# Altium schematic sheet 主板原理图第3次.SchDoc
size A2
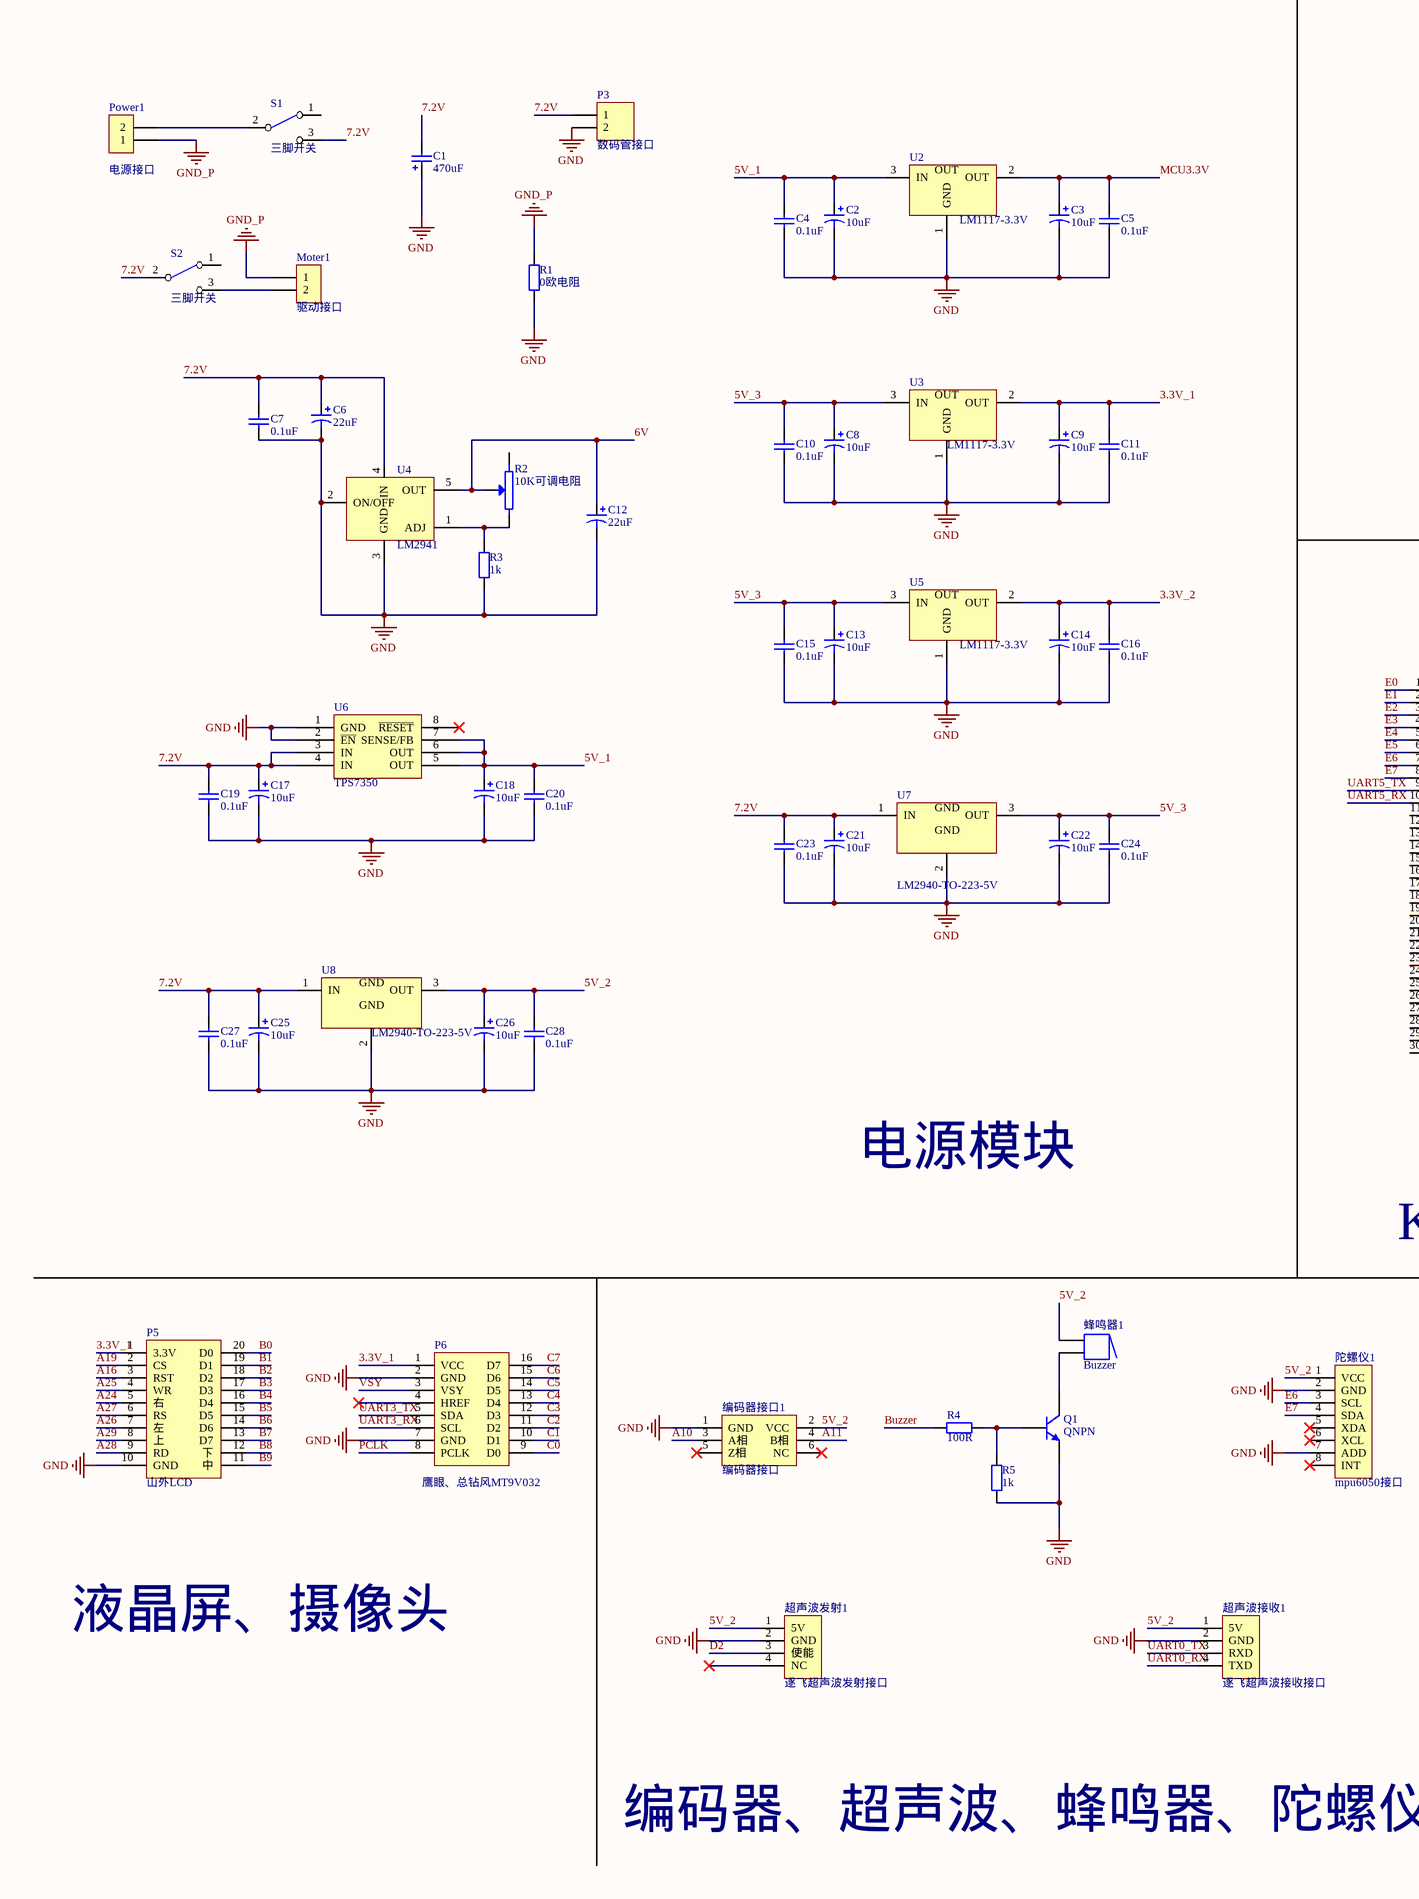
[diagram p0: 主板原理图第3次.SchDoc, left]
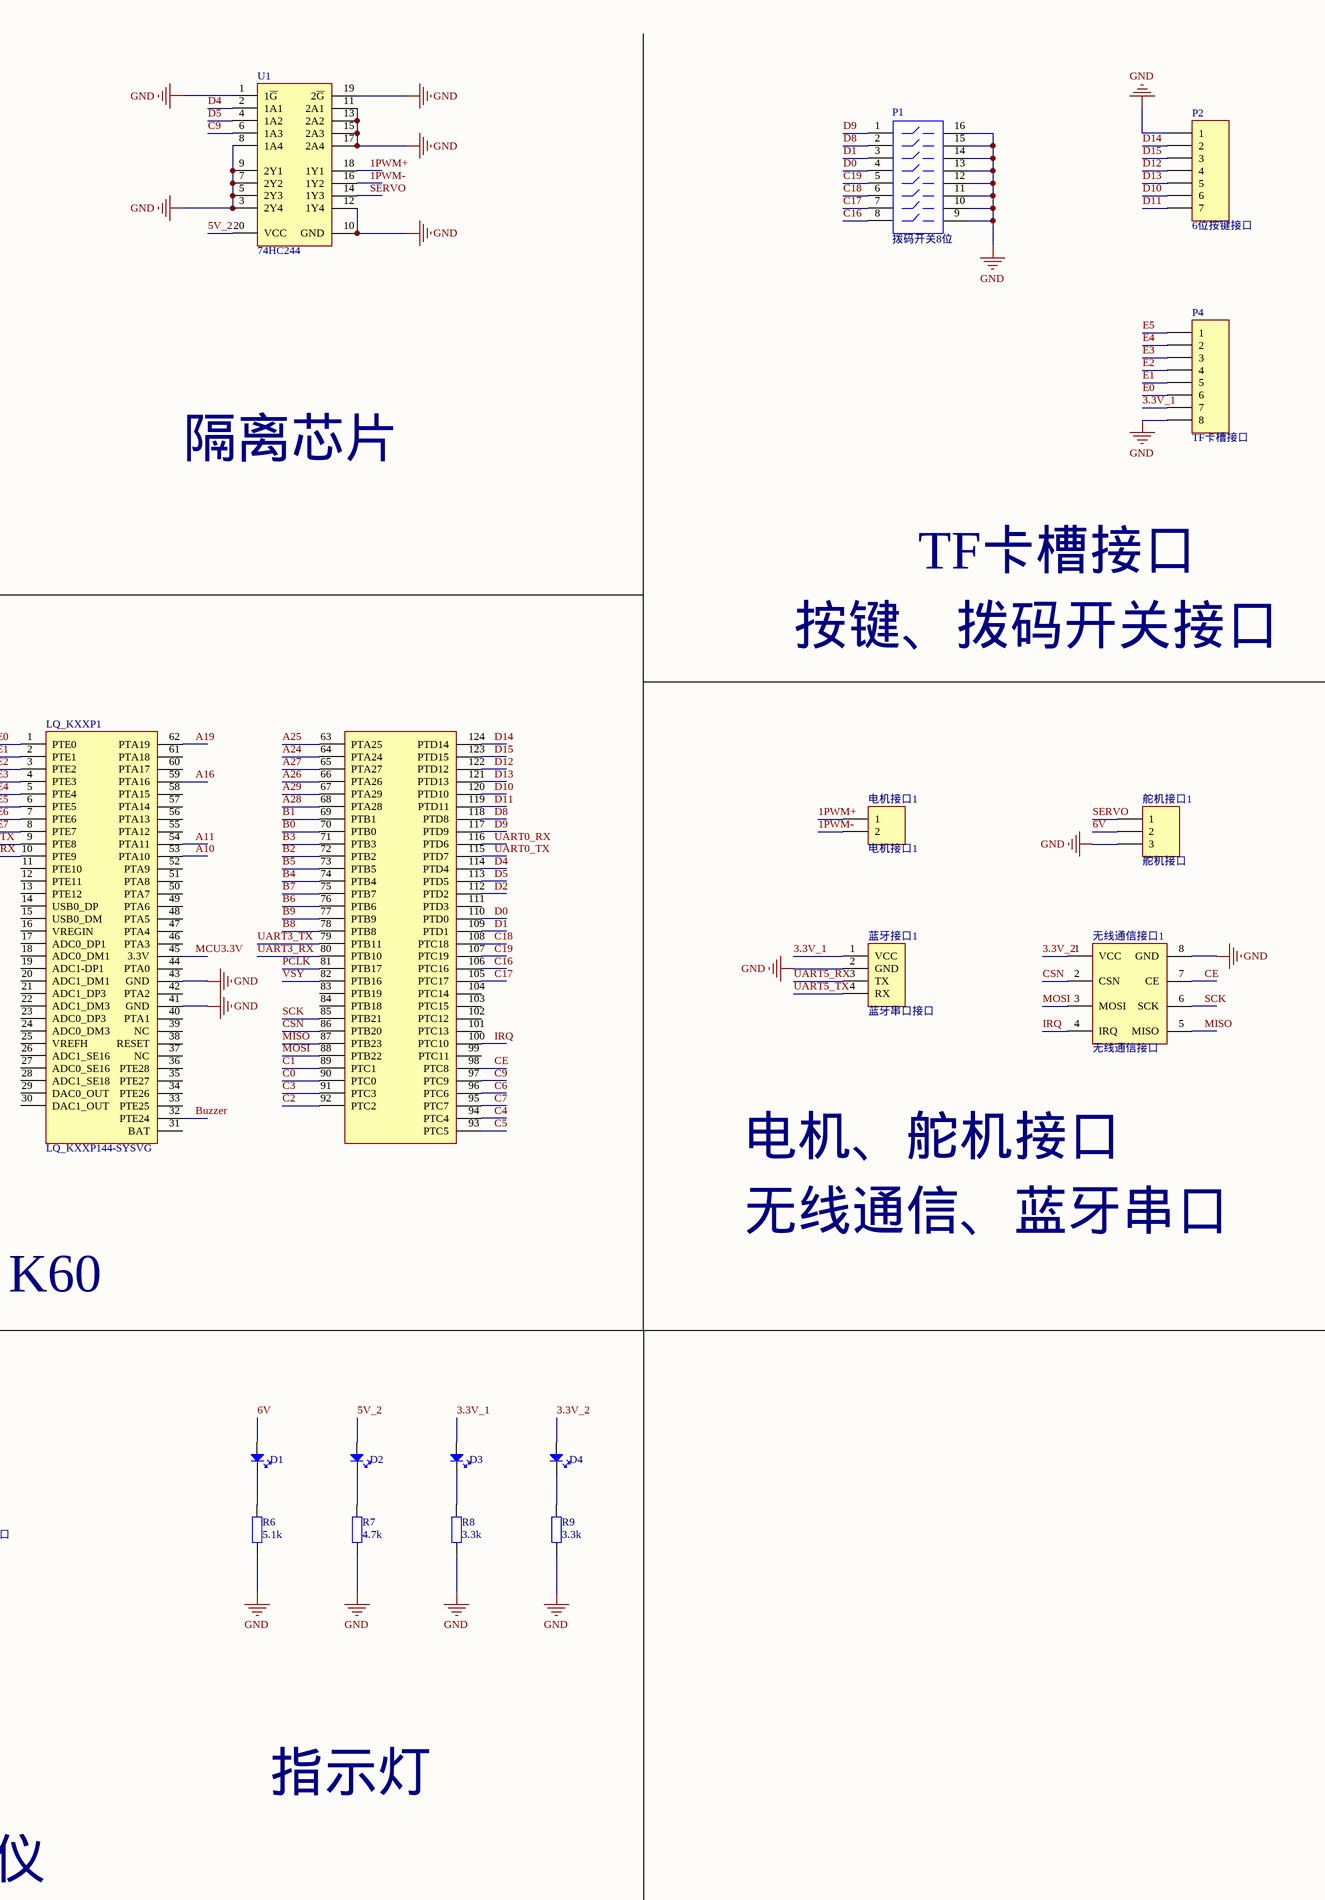
[diagram p1: 主板原理图第3次.SchDoc, right]

## Parts
C1  value 470uF  [C-470uF电解电容]  (hidden comment: C-470uf电解电容)
C2  value 10uF  [10uf钽电容]  (hidden comment: C-10uf钽电容)
C3  value 10uF  [10uf钽电容]  (hidden comment: C-10uf钽电容)
C4  value 0.1uF  [0805]  (hidden comment: C-0.1uf)
C5  value 0.1uF  [0805]  (hidden comment: C-0.1uf)
C6  value 22uF  [C-22uf钽电容]  (hidden comment: C-22uf钽电容)
C7  value 0.1uF  [0805]  (hidden comment: C-0.1uf)
C8  value 10uF  [10uf钽电容]  (hidden comment: C-10uf钽电容)
C9  value 10uF  [10uf钽电容]  (hidden comment: C-10uf钽电容)
C10  value 0.1uF  [0805]  (hidden comment: C-0.1uf)
C11  value 0.1uF  [0805]  (hidden comment: C-0.1uf)
C12  value 22uF  [C-22uf钽电容]  (hidden comment: C-22uf钽电容)
C13  value 10uF  [10uf钽电容]  (hidden comment: C-10uf钽电容)
C14  value 10uF  [10uf钽电容]  (hidden comment: C-10uf钽电容)
C15  value 0.1uF  [0805]  (hidden comment: C-0.1uf)
C16  value 0.1uF  [0805]  (hidden comment: C-0.1uf)
C17  value 10uF  [10uf钽电容]  (hidden comment: C-10uf钽电容)
C18  value 10uF  [10uf钽电容]  (hidden comment: C-10uf钽电容)
C19  value 0.1uF  [0805]  (hidden comment: C-0.1uf)
C20  value 0.1uF  [0805]  (hidden comment: C-0.1uf)
C21  value 10uF  [10uf钽电容]  (hidden comment: C-10uf钽电容)
C22  value 10uF  [10uf钽电容]  (hidden comment: C-10uf钽电容)
C23  value 0.1uF  [0805]  (hidden comment: C-0.1uf)
C24  value 0.1uF  [0805]  (hidden comment: C-0.1uf)
C25  value 10uF  [10uf钽电容]  (hidden comment: C-10uf钽电容)
C26  value 10uF  [10uf钽电容]  (hidden comment: C-10uf钽电容)
C27  value 0.1uF  [0805]  (hidden comment: C-0.1uf)
C28  value 0.1uF  [0805]  (hidden comment: C-0.1uf)
D1  (no value)  [LED-0805]
D2  (no value)  [LED-0805]
D3  (no value)  [LED-0805]
D4  (no value)  [LED-0805]
LQ_KXXP1  LQ_KXXP144-SYSVG  [LQ_KXXP144-SYSVG]
Moter1  驱动接口  [14AWG接口x2]
P1  拨码开关8位  [拨码开关8位]
P2  6位按键接口  [HDR7X1]
P3  数码管接口  [HDR2X1]
P4  TF卡槽接口  [HDR8X1]
P5  山外LCD  [山外LCD插座]
P6  鹰眼、总钻风MT9V032  [总钻风MT9V032]
Power1  电源接口  [14AWG接口x2]
Q1  QNPN  [J3Y晶体管]
R1  0欧电阻  [0805]
R2  10K可调电阻  [10K贴片可调电阻]
R3  1k  [0805]
R4  100R  [0805]
R5  1k  [0805]
R6  5.1k  [0805]
R7  4.7k  [0805]
R8  3.3k  [0805]
R9  3.3k  [0805]
S1  三脚开关  [大开关]
S2  三脚开关  [大开关]
U1  74HC244  [74HC244]
U2  LM1117-3.3V  [LM1117]
U3  LM1117-3.3V  [LM1117]
U4  LM2941  [LM2941]  (value not drawn)
U5  LM1117-3.3V  [LM1117]
U6  TPS7350  [TPS7350]
U7  LM2940-TO-223-5V  [lm2940-sot223]
U8  LM2940-TO-223-5V  [lm2940-sot223]
无线通信接口1  无线通信接口  [无线通信接口]
电机接口1  电机接口1  [白插座2X1]
编码器接口1  编码器接口  [编码器接口]
舵机接口1  舵机接口  [白插座3X1]
蓝牙接口1  蓝牙串口接口  [蓝牙串口接口]
蜂鸣器1  Buzzer  [蜂鸣器]
超声波发射1  逐飞超声波发射接口  [逐飞超声波发射接口]
超声波接收1  逐飞超声波接收接口  [逐飞超声波接收接口]
陀螺仪1  mpu6050接口  [mpu6050接口]

## Nets
GND: C1.1 C2.2 C3.2 C4.1 C5.1 C6.2 C7.1 C8.2 C9.2 C10.1 C11.1 C12.2 C13.2 C14.2 C15.2 C16.1 C17.2 C18.2 C19.1 C20.2 C21.2 C22.2 C23.1 C24.1 C25.2 C26.2 C27.1 C28.2 LQ_KXXP1.41(GND) LQ_KXXP1.43(GND) P1.9 P1.10 P1.11 P1.12 P1.13 P1.14 P1.15 P1.16 P2.1 P3.2 P4.8 P5.10(GND) P6.2(GND) P6.7(GND) Q1.2(E) R1.1 R3.1 R5.1 R6.1 R7.1 R8.1 R9.1 U1.1(1~{G}) U1.3(2Y4) U1.5(2Y3) U1.7(2Y2) U1.8(1A4) U1.9(2Y1) U1.10(GND) U1.11(2A1) U1.12(1Y4) U1.13(2A2) U1.15(2A3) U1.17(2A4) U1.19(2~{G}) U2.1(GND) U3.1(GND) U4.2(ON/OFF) U4.3(GND) U5.1(GND) U6.1(GND) U6.2(~{EN}) U7.2(GND) U8.2(GND) 无线通信接口1.8(GND) 编码器接口1.1(GND) 舵机接口1.3 蓝牙接口1.2(GND) 超声波发射1.2(GND) 超声波接收1.2(GND) 陀螺仪1.2(GND) 陀螺仪1.7(ADD)
GND_P: Moter1.1 Power1.1 R1.2
1PWM+: U1.18(1Y1) 电机接口1.1
1PWM-: U1.16(1Y2) 电机接口1.2
3.3V_1: C9.1 C11.2 D3.1(A) P4.7 P5.1(3.3V) P6.1(VCC) U3.2(OUT) 蓝牙接口1.1(VCC)
3.3V_2: C14.1 C16.2 D4.1(A) U5.2(OUT) 无线通信接口1.1(VCC)
5V_1: C2.1 C4.2 C18.1 C20.1 U2.3(IN) U6.5(OUT) U6.6(OUT) U6.7(SENSE/FB)
5V_2: C26.1 C28.1 D2.1(A) U1.20(VCC) U8.3(OUT) 编码器接口1.2(VCC) 蜂鸣器1.1 超声波发射1.1(5V) 超声波接收1.1(5V) 陀螺仪1.1(VCC)
5V_3: C8.1 C10.2 C13.1 C15.1 C22.1 C24.2 U3.3(IN) U5.3(IN) U7.3(OUT)
6V: C12.1 D1.1(A) R2.2(W) U4.5(OUT) 舵机接口1.2
7.2V: C1.2 C6.1 C7.2 C17.1 C19.2 C21.1 C23.2 C25.1 C27.2 P3.1 S1.3(NO) S2.2(COMMON) U4.4(IN) U6.3(IN) U6.4(IN) U7.1(IN) U8.1(IN)
A10: LQ_KXXP1.53(PTA10) 编码器接口1.3(A相)
A11: LQ_KXXP1.54(PTA11) 编码器接口1.4(B相)
A16: LQ_KXXP1.59(PTA16) P5.3(RST)
A19: LQ_KXXP1.62(PTA19) P5.2(CS)
A24: LQ_KXXP1.64(PTA24) P5.5(右)
A25: LQ_KXXP1.63(PTA25) P5.4(WR)
A26: LQ_KXXP1.66(PTA26) P5.7(左)
A27: LQ_KXXP1.65(PTA27) P5.6(RS)
A28: LQ_KXXP1.68(PTA28) P5.9(RD)
A29: LQ_KXXP1.67(PTA29) P5.8(上)
B0: LQ_KXXP1.70(PTB0) P5.20(D0)
B1: LQ_KXXP1.69(PTB1) P5.19(D1)
B2: LQ_KXXP1.72(PTB2) P5.18(D2)
B3: LQ_KXXP1.71(PTB3) P5.17(D3)
B4: LQ_KXXP1.74(PTB4) P5.16(D4)
B5: LQ_KXXP1.73(PTB5) P5.15(D5)
B6: LQ_KXXP1.76(PTB6) P5.14(D6)
B7: LQ_KXXP1.75(PTB7) P5.13(D7)
B8: LQ_KXXP1.78(PTB8) P5.12(下)
B9: LQ_KXXP1.77(PTB9) P5.11(中)
Buzzer: LQ_KXXP1.32(PTE24) R4.1
C0: LQ_KXXP1.90(PTC0) P6.9(D0)
C1: LQ_KXXP1.89(PTC1) P6.10(D1)
C2: LQ_KXXP1.92(PTC2) P6.11(D2)
C3: LQ_KXXP1.91(PTC3) P6.12(D3)
C4: LQ_KXXP1.94(PTC4) P6.13(D4)
C5: LQ_KXXP1.93(PTC5) P6.14(D5)
C6: LQ_KXXP1.96(PTC6) P6.15(D6)
C7: LQ_KXXP1.95(PTC7) P6.16(D7)
C9: LQ_KXXP1.97(PTC9) U1.6(1A3)
C16: LQ_KXXP1.106(PTC16) P1.8
C17: LQ_KXXP1.105(PTC17) P1.7
C18: LQ_KXXP1.108(PTC18) P1.6
C19: LQ_KXXP1.107(PTC19) P1.5
CE: LQ_KXXP1.98(PTC8) 无线通信接口1.7(CE)
CSN: LQ_KXXP1.86(PTB20) 无线通信接口1.2(CSN)
D0: LQ_KXXP1.110(PTD0) P1.4
D1: LQ_KXXP1.109(PTD1) P1.3
D2: LQ_KXXP1.112(PTD2) 超声波发射1.3(使能)
D4: LQ_KXXP1.114(PTD4) U1.2(1A1)
D5: LQ_KXXP1.113(PTD5) U1.4(1A2)
D8: LQ_KXXP1.118(PTD8) P1.2
D9: LQ_KXXP1.117(PTD9) P1.1
D10: LQ_KXXP1.120(PTD10) P2.6
D11: LQ_KXXP1.119(PTD11) P2.7
D12: LQ_KXXP1.122(PTD12) P2.4
D13: LQ_KXXP1.121(PTD13) P2.5
D14: LQ_KXXP1.124(PTD14) P2.2
D15: LQ_KXXP1.123(PTD15) P2.3
E0: LQ_KXXP1.1(PTE0) P4.6
E1: LQ_KXXP1.2(PTE1) P4.5
E2: LQ_KXXP1.3(PTE2) P4.4
E3: LQ_KXXP1.4(PTE3) P4.3
E4: LQ_KXXP1.5(PTE4) P4.2
E5: LQ_KXXP1.6(PTE5) P4.1
E6: LQ_KXXP1.7(PTE6) 陀螺仪1.3(SCL)
E7: LQ_KXXP1.8(PTE7) 陀螺仪1.4(SDA)
IRQ: LQ_KXXP1.100(PTC10) 无线通信接口1.4(IRQ)
MCU3.3V: C3.1 C5.2 LQ_KXXP1.45(3.3V) U2.2(OUT)
MISO: LQ_KXXP1.87(PTB23) 无线通信接口1.5(MISO)
MOSI: LQ_KXXP1.88(PTB22) 无线通信接口1.3(MOSI)
PCLK: LQ_KXXP1.81(PTB17) P6.8(PCLK)
SCK: LQ_KXXP1.85(PTB21) 无线通信接口1.6(SCK)
SERVO: U1.14(1Y3) 舵机接口1.1
UART0_RX: LQ_KXXP1.116(PTD6) 超声波接收1.4(TXD)
UART0_TX: LQ_KXXP1.115(PTD7) 超声波接收1.3(RXD)
UART3_RX: LQ_KXXP1.80(PTB10) P6.6(SCL)
UART3_TX: LQ_KXXP1.79(PTB11) P6.5(SDA)
UART5_RX: LQ_KXXP1.10(PTE9) 蓝牙接口1.3(TX)
UART5_TX: LQ_KXXP1.9(PTE8) 蓝牙接口1.4(RX)
VSY: LQ_KXXP1.82(PTB16) P6.3(VSY)
NetD1_2: D1.2(K) R6.2
NetD2_2: D2.2(K) R7.2
NetD3_2: D3.2(K) R8.2
NetD4_2: D4.2(K) R9.2
NetMoter1_2: Moter1.2 S2.3(NO)
NetPower1_2: Power1.2 S1.2(COMMON)
NetQ1_1: Q1.1(B) R4.2 R5.2
NetQ1_3: Q1.3(C) 蜂鸣器1.2
NetR2_1: R2.1 R3.2 U4.1(ADJ)

Not connected (* = marked no-connect by the designer): LQ_KXXP1 11(PTE10) 12(PTE11) 13(PTE12) 14(USB0_DP) 15(USB0_DM) 16(VREGIN) 17(ADC0_DP1) 18(ADC0_DM1) 19(ADC1-DP1) 20(ADC1_DM1) 21(ADC1_DP3) 22(ADC1_DM3) 23(ADC0_DP3) 24(ADC0_DM3) 25(VREFH) 26(ADC1_SE16) 27(ADC0_SE16) 28(ADC1_SE18) 29(DAC0_OUT) 30(DAC1_OUT) 31(BAT) 33(PTE25) 34(PTE26) 35(PTE27) 36(PTE28) 37(NC) 38(RESET) 39(NC) 40(PTA1) 42(PTA2) 44(PTA0) 46(PTA3) 47(PTA4) 48(PTA5) 49(PTA6) 50(PTA7) 51(PTA8) 52(PTA9) 55(PTA12) 56(PTA13) 57(PTA14) 58(PTA15) 60(PTA17) 61(PTA18) 83(PTB19) 84(PTB18) 99(PTC11) 101(PTC13) 102(PTC12) 103(PTC15) 104(PTC14) 111(PTD3); P6 4(HREF)*; R2 3; S1 1(NC); S2 1(NC); U6 8(~{RESET})*; 编码器接口1 5(Z相)* 6(NC)*; 超声波发射1 4(NC)*; 陀螺仪1 5(XDA)* 6(XCL)* 8(INT)*

## Notes on the sheet
- 隔离芯片
- (near U4) LM2941
- TF卡槽接口
- 按键、拨码开关接口
- 电机、舵机接口
- 电源模块
- 无线通信、蓝牙串口
- K60
- 液晶屏、摄像头
- 指示灯
- 编码器、超声波、蜂鸣器、陀螺仪

## Library data of the parts
C1 = C-470uf电解电容: Polarized Capacitor (Surface Mount); Published: 8-Jun-2000; LatestRevisionDate: 29-May-2009; LatestRevisionNote: IPC-7351 Footprint Added.; PackageReference: C0805; Publisher: Altium Limited; PackageDescription: Chip Capacitor
C2 C3 C8 C9 C13 C14 C17 C18 C21 C22 C25 C26 = C-10uf钽电容: Polarized Capacitor (Axial)
C4 C5 C7 C10 C11 C15 C16 C19 C20 C23 C24 C27 C28 = C-0.1uf: Capacitor; Published: 8-Jun-2000; LatestRevisionDate: 17-Jul-2002; LatestRevisionNote: Re-released for DXP Platform.; PackageReference: RAD-0.3; Publisher: Altium Limited; PackageDescription: Radial Cap, Thru-Hole; 2 Leads; 0.3 in Pin Spacing
C6 C12 = C-22uf钽电容: Polarized Capacitor (Axial)
D1-D4 = 发光二极管
Moter1 = 电源接口
P2 = Header7X1: Header, 7-Pin; LatestRevisionDate: 17-Jul-2002; LatestRevisionNote: Re-released for DXP Platform.; Publisher: Altium Limited
P3 电机接口1 = Header2X1: Header, 2-Pin, Right Angle; LatestRevisionDate: 17-Jul-2002; LatestRevisionNote: Re-released for DXP Platform.; Publisher: Altium Limited
P4 = Header8X1: Header, 8-Pin; LatestRevisionDate: 17-Jul-2002; LatestRevisionNote: Re-released for DXP Platform.; Publisher: Altium Limited
P5 = 山外LCD: Header, 4-Pin, Dual row; LatestRevisionDate: 17-Jul-2002; LatestRevisionNote: Re-released for DXP Platform.; Publisher: Altium Limited
P6 = 总钻风MT9V032: Header, 4-Pin, Dual row; LatestRevisionDate: 17-Jul-2002; LatestRevisionNote: Re-released for DXP Platform.; Publisher: Altium Limited
Q1 = dynatron: NPN型三极管
R1 R3-R9 = R-0805
R2 = 可调电阻
U1 = 74HC244: 内置三态门 用于隔离
U2 U3 U5 = LM1117
U7 = LM2940-TO-223
U8 = LM2940
无线通信接口1 = 无线通信接口: Header, 4-Pin, Dual row; LatestRevisionDate: 17-Jul-2002; LatestRevisionNote: Re-released for DXP Platform.; Publisher: Altium Limited
舵机接口1 = Header3X1: Header, 3-Pin; LatestRevisionDate: 17-Jul-2002; LatestRevisionNote: Re-released for DXP Platform.; Publisher: Altium Limited
蓝牙接口1 = 蓝牙串口接口: Header, 4-Pin; LatestRevisionDate: 17-Jul-2002; LatestRevisionNote: Re-released for DXP Platform.; Publisher: Altium Limited
蜂鸣器1 = Buzzer: Magnetic Transducer Buzzer
超声波发射1 = 逐飞超声波发射接口: Header, 4-Pin; LatestRevisionDate: 17-Jul-2002; LatestRevisionNote: Re-released for DXP Platform.; Publisher: Altium Limited
超声波接收1 = 逐飞超声波接收接口: Header, 4-Pin; LatestRevisionDate: 17-Jul-2002; LatestRevisionNote: Re-released for DXP Platform.; Publisher: Altium Limited
陀螺仪1 = mpu6050接口: Header, 8-Pin; LatestRevisionDate: 17-Jul-2002; LatestRevisionNote: Re-released for DXP Platform.; Publisher: Altium Limited